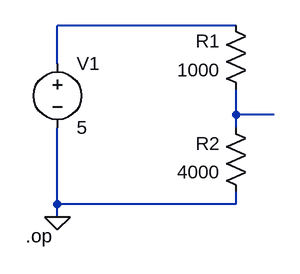
[diagram p0: schematic voltage divider.asc]
voltage divider.asc, the LTspice schematic file:
Version 4
SHEET 1 880 680
WIRE 352 96 128 96
WIRE 128 144 128 96
WIRE 352 208 352 176
WIRE 400 208 352 208
WIRE 352 224 352 208
WIRE 128 320 128 224
WIRE 352 320 352 304
WIRE 352 320 128 320
WIRE 128 336 128 320
FLAG 128 336 0
SYMBOL voltage 128 128 R0
SYMATTR InstName V1
SYMATTR Value 5
SYMBOL res 368 192 R180
WINDOW 0 36 76 Left 2
WINDOW 3 36 40 Left 2
SYMATTR InstName R1
SYMATTR Value 1000
SYMBOL res 368 320 R180
WINDOW 0 36 76 Left 2
WINDOW 3 36 40 Left 2
SYMATTR InstName R2
SYMATTR Value 4000
TEXT 88 360 Left 2 !.op

The netlist it stands for:
* voltage divider.asc
V1 N001 0 5
R1 N002 N001 1000
R2 0 N002 4000
.op
.backanno
.end